# Altium schematic sheet Ring_wearable_ver3.4.SchDoc
size A2; SheetNumber: 1; SheetTotal: 2; SPICEModelCacheLMPAKEDT: <root> / <DocumentId>LMPAKEDT</DocumentId> / </root>
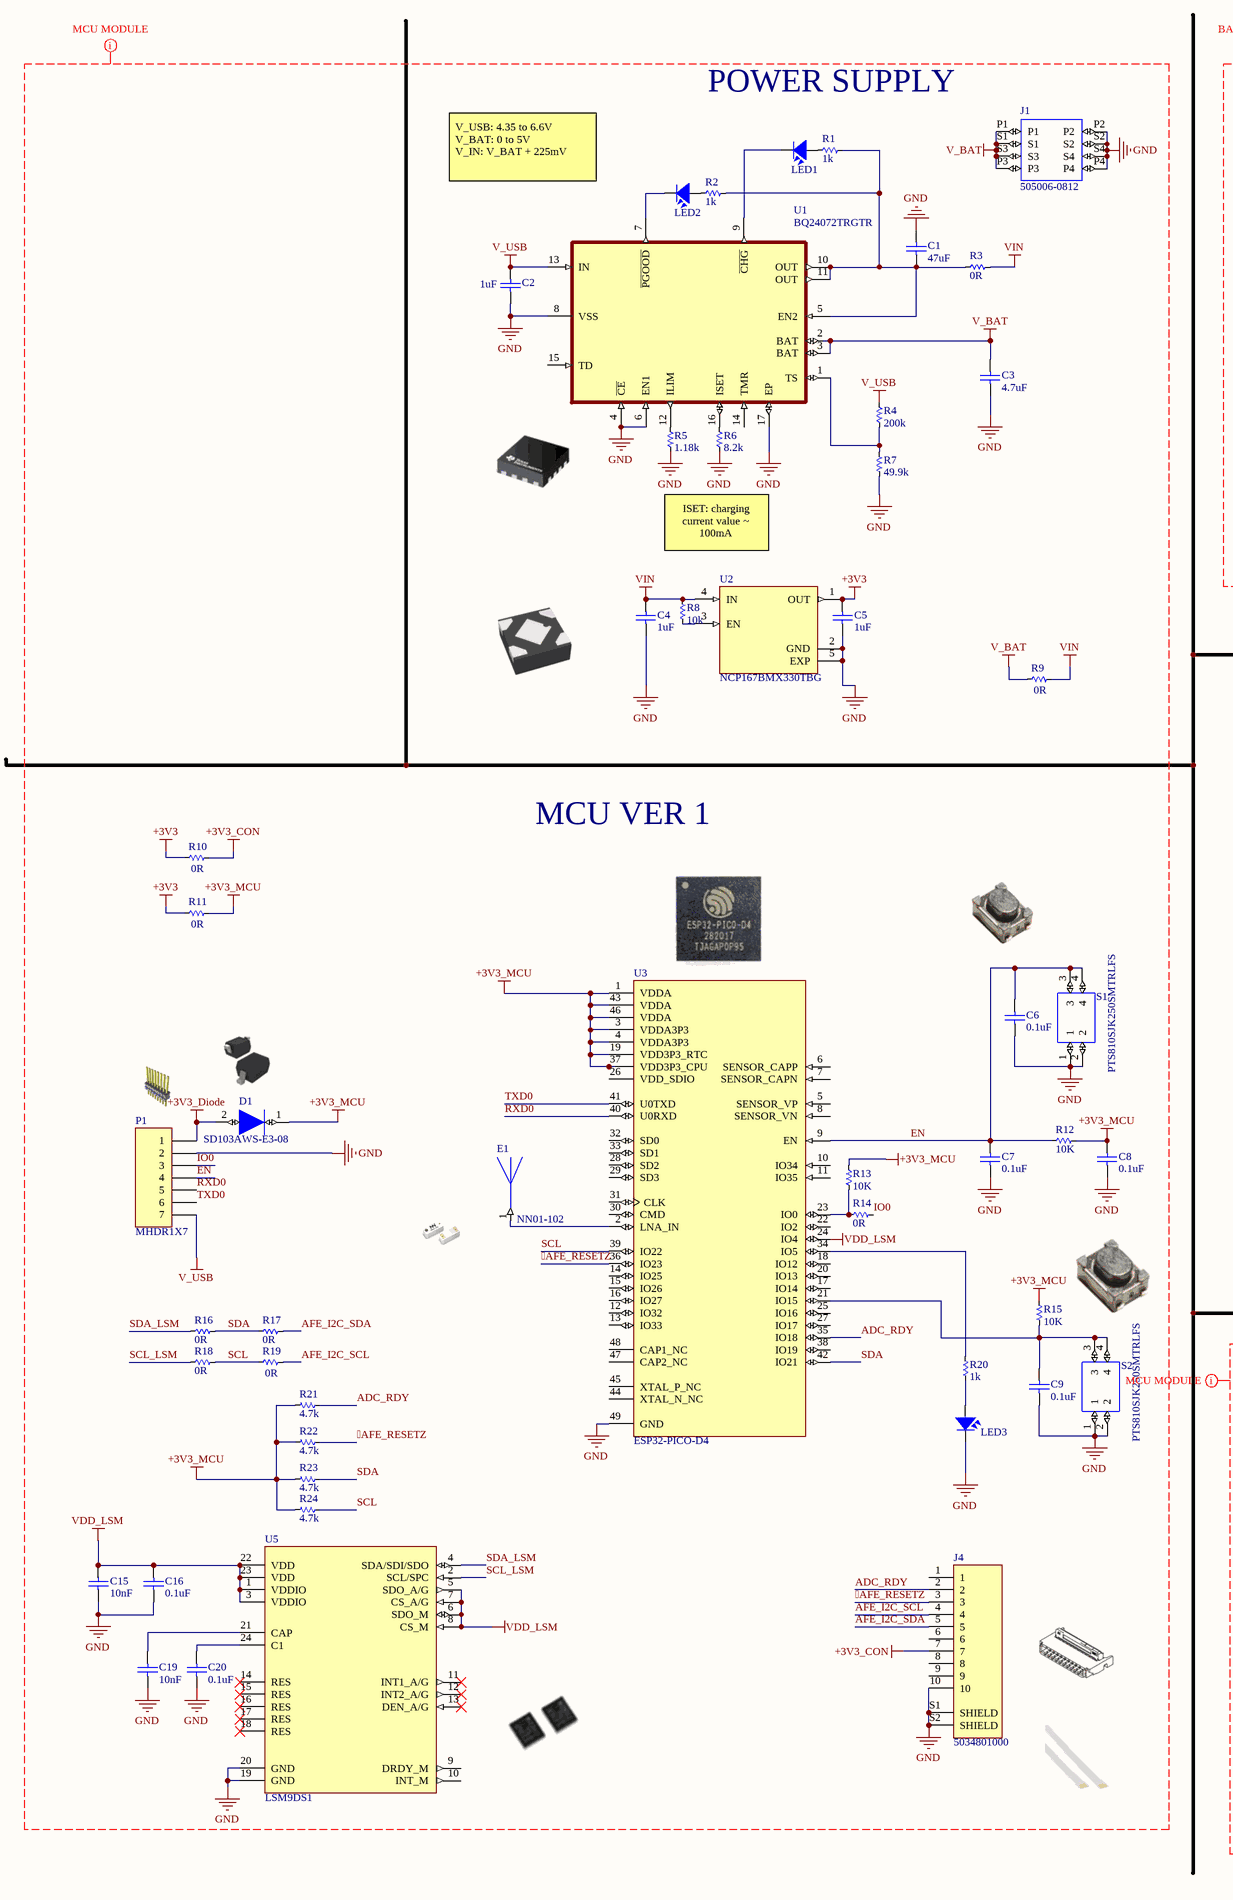
[diagram p0: Ring_wearable_ver3.4.SchDoc, left]
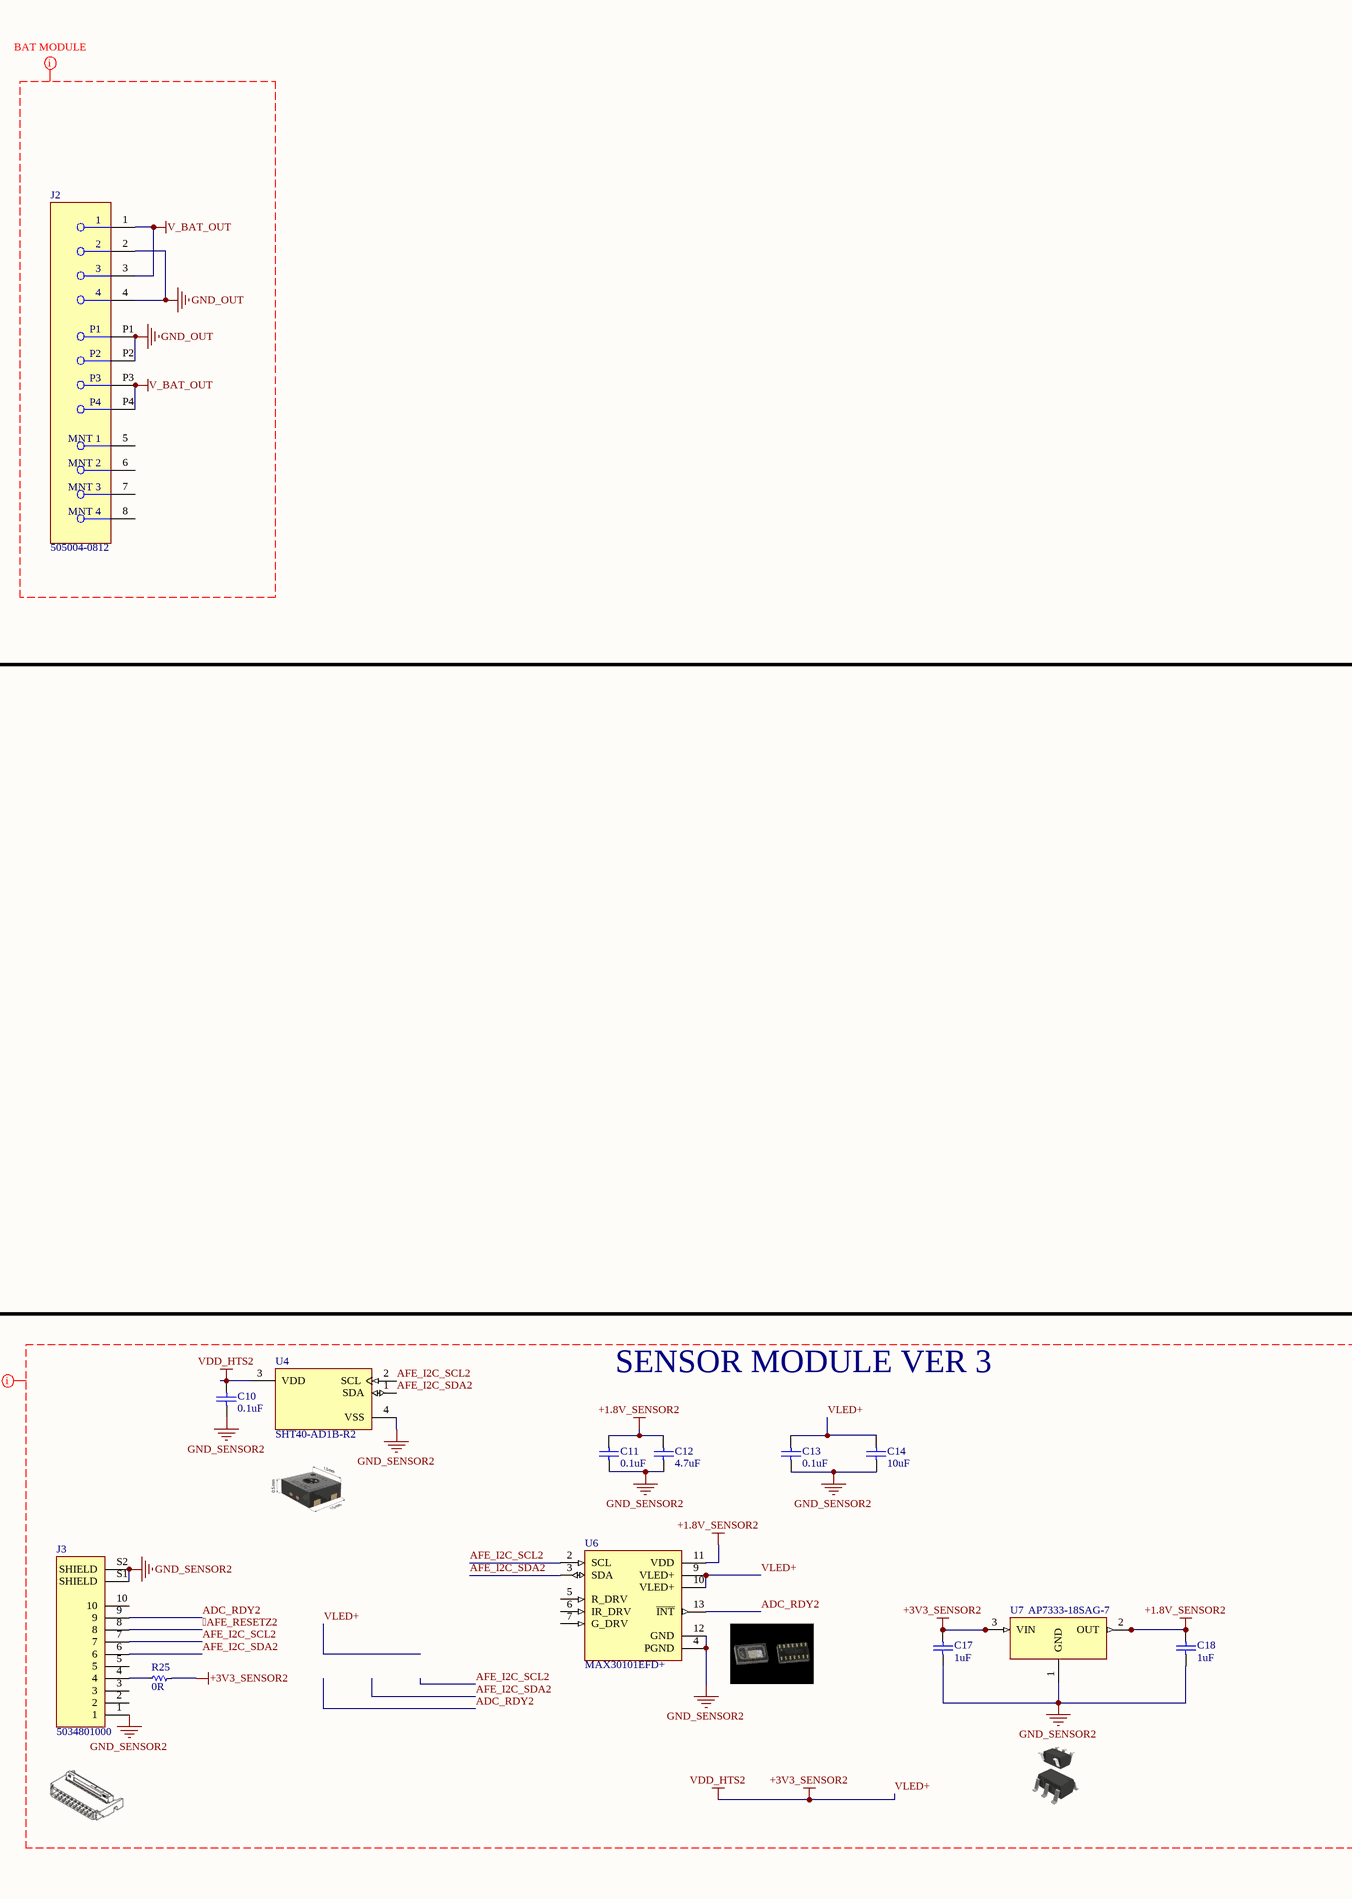
[diagram p1: Ring_wearable_ver3.4.SchDoc, right]

## Parts
C1  4.7uF  [RES-SMD-0402]  (value not drawn)
C2  1uF  [RES-SMD-0402]
C3  4.7uF  [RES-SMD-0402]
C4  1uF  [RES-SMD-0402]
C5  1uF  [RES-SMD-0402]
C6  0.1uF  [RES-SMD-0402]
C7  0.1uF  [RES-SMD-0603]
C8  0.1uF  [RES-SMD-0402]
C9  0.1uF  [RES-SMD-0402]
C10  0.1uF  [RES-SMD-0402]
C11  0.1uF  [RES-SMD-0402]
C12  4.7uF  [RES-SMD-0402]
C13  0.1uF  [RES-SMD-0402]
C14  10uF  [RES-SMD-0402]
C15  10nF  [RES-SMD-0402]
C16  0.1uF  [RES-SMD-0402]
C17  1uF  [RES-SMD-0402]
C18  1uF  [RES-SMD-0402]
C19  10nF  [RES-SMD-0402]
C20  0.1uF  [RES-SMD-0402]
D1  SD103AWS-E3-08  [SOD2713X115N]
E1  NN01-102  [XCVR_NN01-102]
J1  505006-0812  [5050060812]
J2  505004-0812  [FP-505004-0812-MFG]
J3  5034801000  [MOLEX_5034801000]
J4  5034801000  [MOLEX_5034801000]
LED1  LED_INDICATE1  [LED-0402]  (value not drawn)
LED2  LED_INDICATE2  [LED-0402]  (value not drawn)
LED3  LED_INDICATE3  [LED-0402]  (value not drawn)
P1  MHDR1X7  [MHDR1X7]
R1  1k  [RES-SMD-0402]
R2  1k  [RES-SMD-0402]
R3  0R  [RES-SMD-0402]
R4  200k  [RES-SMD-0402]
R5  1.18k  [RES-SMD-0402]
R6  8.2k  [RES-SMD-0402]
R7  49.9k  [RES-SMD-0402]
R8  10k  [RES-SMD-0402]
R9  0R  [RES-SMD-0402]
R10  0R  [RES-SMD-0402]
R11  0R  [RES-SMD-0402]
R12  10K  [RES-SMD-0402]
R13  10K  [RES-SMD-0603]
R14  0R  [RES-SMD-0603]
R15  10K  [RES-SMD-0402]
R16  0R  [RES-SMD-0402]
R17  0R  [RES-SMD-0402]
R18  0R  [RES-SMD-0402]
R19  0R  [RES-SMD-0402]
R20  1k  [RES-SMD-0402]
R21  4.7k  [RES-SMD-0402]
R22  4.7k  [RES-SMD-0402]
R23  4.7k  [RES-SMD-0402]
R24  4.7k  [RES-SMD-0402]
R25  0R  [RES-SMD-0402]
S1  PTS810SJK250SMTRLFS  [PTS810SJG250SMTRLFS]
S2  PTS810SJK250SMTRLFS  [PTS810SJG250SMTRLFS]
U1  BQ24072TRGTR  [QFN50P300X300X100-17N]
U2  NCP167BMX330TBG  [REG_NCP167BMX330TBG]
U3  ESP32-PICO-D4  [PQFN50P700X700X104-49N]
U4  SHT40-AD1B-R2  [FP-SHT40-AD1B-R2-MFG]
U5  LSM9DS1  [PQFN24P43_350X300X102L35X23N]
U6  MAX30101EFD+  [PSON80P330X560X165-14N]
U7  AP7333-18SAG-7  [SOT23-132]

## Nets
+1.8V_SENSOR2: C11.1 C12.1 C18.1 U6.11(VDD) U7.2(OUT)
+3V3: C5.1 R10.2 R11.2 U2.1(OUT)
+3V3_CON: J4.7 R10.1
+3V3_Diode: D1.2(A) P1.1
+3V3_MCU: C8.1 D1.1(K) R11.1 R12.1 R13.1 R15.1 R21.1 R22.1 R23.1 R24.1 U3.1(VDDA) U3.3(VDDA3P3) U3.4(VDDA3P3) U3.19(VDD3P3_RTC) U3.37(VDD3P3_CPU) U3.43(VDDA) U3.46(VDDA)
GND: C1.1 C2.1 C3.2 C4.2 C5.2 C6.2 C7.2 C8.2 C9.2 C15.2 C16.2 C19.2 C20.2 J1.P2 J1.P4 J1.S2 J1.S4 J4.10 J4.S1(SHIELD) J4.S2(SHIELD) LED3.2 P1.2 R5.1 R6.1 R7.1 S1.1 S1.2 S2.1 S2.2 U1.4(~{CE}) U1.6(EN1) U1.8(VSS) U1.17(EP) U2.2(GND) U2.5(EXP) U3.49(GND) U5.19(GND) U5.20(GND)
GND_OUT: J2.2 J2.4 J2.P1 J2.P2
GND_SENSOR2: C10.2 C11.2 C12.2 C13.2 C14.2 C17.2 C18.2 J3.1 J3.S1(SHIELD) J3.S2(SHIELD) U4.4(VSS) U6.4(PGND) U6.12(GND) U7.1(GND)
V_BAT: C3.1 J1.P1 J1.P3 J1.S1 J1.S3 R9.2 U1.2(BAT) U1.3(BAT)
V_BAT_OUT: J2.1 J2.3 J2.P3 J2.P4
V_USB: C2.2 P1.7 R4.2 U1.13(IN)
VDD_LSM: C15.1 C16.1 U3.24(IO4) U5.1(VDDIO) U5.3(VDDIO) U5.5(SDO_A/G) U5.6(SDO_M) U5.7(CS_A/G) U5.8(CS_M) U5.22(VDD) U5.23(VDD)
VIN: C4.1 R3.1 R8.2 R9.1 U2.4(IN)
VLED+: C10.1 C13.1 C14.1 C17.1 R25.1 U4.3(VDD) U6.9(VLED+) U6.10(VLED+) U7.3(VIN)  [also labelled +3V3_SENSOR2, VDD_HTS2]
AFE_RESETZ: J4.3 R22.2 U3.36(IO23)
AFE_RESETZ2: J3.8
ADC_RDY: J4.2 R21.2 U3.35(IO18)
ADC_RDY2: J3.9 U6.13(~{INT})
AFE_I2C_SCL: J4.4 R19.1
AFE_I2C_SCL2: J3.7 U4.2(SCL) U6.2(SCL)
AFE_I2C_SDA: J4.5 R17.1
AFE_I2C_SDA2: J3.6 U4.1(SDA) U6.3(SDA)
EN: C6.1 C7.1 P1.4 R12.2 S1.3 S1.4 U3.9(EN)
IO0: P1.3 R14.1
RXD0: P1.5 U3.40(U0RXD)
SCL: R18.1 R19.2 R24.2 U3.39(IO22)
SCL_LSM: R18.2 U5.2(SCL/SPC)
SDA: R16.1 R17.2 R23.2 U3.42(IO21)
SDA_LSM: R16.2 U5.4(SDA/SDI/SDO)
TXD0: P1.6 U3.41(U0TXD)
NetC1_2: C1.2 R1.1 R2.1 R3.2 U1.5(EN2) U1.10(OUT) U1.11(OUT)
NetC9_1: C9.1 R15.2 S2.3 S2.4 U3.21(IO15)
NetC19_1: C19.1 U5.21(CAP)
NetC20_1: C20.1 U5.24(C1)
NetE1_1: E1.1 U3.2(LNA_IN)
NetJ3_4: J3.4 R25.2
NetLED1_1: LED1.1 R1.2
NetLED1_2: LED1.2 U1.9(~{CHG})
NetLED2_1: LED2.1 R2.2
NetLED2_2: LED2.2 U1.7(~{PGOOD})
NetLED3_1: LED3.1 R20.2
NetR4_1: R4.1 R7.2 U1.1(TS)
NetR5_2: R5.2 U1.12(ILIM)
NetR6_2: R6.2 U1.16(ISET)
NetR8_1: R8.1 U2.3(EN)
NetR13_2: R13.2 R14.2 U3.23(IO0)
NetR20_1: R20.1 U3.34(IO5)

Not connected (* = marked no-connect by the designer): J2 5(MNT_1) 6(MNT_2) 7(MNT_3) 8(MNT_4); J3 2 3 5 10; J4 1 6 8 9; U1 14(TMR) 15(TD); U3 5(SENSOR_VP) 6(SENSOR_CAPP) 7(SENSOR_CAPN) 8(SENSOR_VN) 10(IO34) 11(IO35) 12(IO32) 13(IO33) 14(IO25) 15(IO26) 16(IO27) 17(IO14) 18(IO12) 20(IO13) 22(IO2) 25(IO16) 26(VDD_SDIO) 27(IO17) 28(SD2) 29(SD3) 30(CMD) 31(CLK) 32(SD0) 33(SD1) 38(IO19) 44(XTAL_N_NC) 45(XTAL_P_NC) 47(CAP2_NC) 48(CAP1_NC); U5 9(DRDY_M) 10(INT_M) 11(INT1_A/G)* 12(INT2_A/G)* 13(DEN_A/G)* 14(RES)* 15(RES)* 16(RES)* 17(RES)* 18(RES)*; U6 5(R_DRV) 6(IR_DRV) 7(G_DRV)

## Layout directives
net class MCU: AFE_RESETZ, AFE_RESETZ2, +1.8V_SENSOR2, +3V3, +3V3_CON, +3V3_Diode, +3V3_MCU, +3V3_SENSOR2, ADC_RDY, ADC_RDY2, AFE_I2C_SCL, AFE_I2C_SCL2, AFE_I2C_SDA, AFE_I2C_SDA2, EN, GND, GND_SENSOR2, IO0, RXD0, SCL, SCL_LSM, SDA, SDA_LSM, TXD0, V_BAT, V_USB, VDD_HTS2, VDD_LSM, VIN, VLED+
net class BAT MODULE: GND_OUT, V_BAT_OUT

## Notes on the sheet
- POWER SUPPLY
- V_USB: 4.35 to 6.6V
  V_BAT: 0 to 5V
  V_IN: V_BAT + 225mV
- ISET: charging current value ~ 100mA
- MCU VER 1
- SENSOR MODULE VER 3
- (in symbol Cap) 47uF

## Library data of the parts
C1-C20 = Cap: Capacitor; Published: 8-Jun-2000; LatestRevisionDate: 17-Jul-2002; LatestRevisionNote: Re-released for DXP Platform.; PackageReference: RAD-0.3; Publisher: Altium Limited; PackageDescription: Radial Cap, Thru-Hole; 2 Leads; 0.3 in Pin Spacing
D1 = SD103AWS-E3-08: Ð”Ð¸Ð¾Ð´ Ð¨Ð¾Ñ‚Ñ‚ÐºÐ¸ 40 Ð’ 350 Ð¼Ð (DC) Ð´Ð»Ñ Ð¿Ð¾Ð²ÐµÑ€Ñ…Ð½Ð¾ÑÑ‚Ð½Ð¾Ð³Ð¾ Ð¼Ð¾Ð½Ñ‚Ð°Ð¶Ð° SOD-323; MF: Vishay; SnapEDA_Link: https://www.snapeda.com/parts/SD103AWS-E3-08/Vishay+Semiconductor+Diodes+Division/view-part/?ref=snap; Value: *; Purchase-URL: https://pricing.snapeda.com/search/part/SD103AWS-E3-08/?ref=eda; Digi-Key_Part_Number: SD103AWS-E3-08GITR-ND; Check_prices: https://www.snapeda.com/parts/SD103AWS-E3-08/Vishay+Semiconductor+Diodes+Division/view-part/?ref=eda; MP: SD103AWS-E3-08; Package: SOD-323 Vishay Semiconductor Diodes Division
E1 = NN01-102: 2.45GHz Bluetooth, WLAN, Zigbeeâ„¢ Chip RF Antenna 2.4GHz ~ 2.5GHz 1.7dBi Solder Surface Mount; MF: Ignion; Price: None; Availability: In Stock; Check_prices: https://www.snapeda.com/parts/NN01-102/Ignion/view-part/5139104/?ref=eda; Value: *; MP: NN01-102; Package: None; SnapEDA_Link: https://www.snapeda.com/parts/NN01-102/Ignion/view-part/5139104/?ref=snap
J1 = 505006-0812: 8 (4 + 4 Power) Position Connector Plug, Outer Shroud Contacts Surface Mount Gold; MF: Molex; Value: *; SnapEDA_Link: https://www.snapeda.com/parts/505006-0812/Molex/view-part/3230025/?ref=snap; Package: None; Check_prices: https://www.snapeda.com/parts/505006-0812/Molex/view-part/3230025/?ref=eda; MP: 505006-0812; Availability: Unavailable; Price: None
J2 = CMP-04776-000740-1: CONN RCPT 4POS SMD GOLD
J3 J4 = 5034801000: 10 Position FFC, FPC Connector Contacts, Top and Bottom 0.020 _0.50mm_ Surface Mount, Right Angle; MF: Molex; Digi-Key_Part_Number: WM1389CT-ND; Package: None; MP: 5034801000; Digi-Key_Purchase_URL: https://www.digikey.com/product-detail/en/molex/5034801000/WM1389CT-ND/2356643?utm_source=snapeda&utm_medium=aggregator&utm_campaign=symbol; SnapEDA_Link: https://www.snapeda.com/parts/5034801000/Molex/view-part/2746786/?ref=snap; Value: *
LED1-LED3 = LED: LED Single colour Green and Red; Value: LED 3 ly Single Colour
P1 = MHDR1X7: Header, 7-Pin; LatestRevisionDate: 17-Jul-2002; LatestRevisionNote: Re-released for DXP Platform.; Publisher: Altium Limited
R1-R25 = Res-SMD: Resistor; Manufacturer: Generic Components; Class: Passive; Published: 08/06/2000; Publisher: Altium Hobart Technology Centre
S1 S2 = PTS810SJK250SMTRLFS: Tactile Switch SPST-NO Top Actuated Surface Mount; MF: C&K; SnapEDA_Link: https://www.snapeda.com/parts/PTS810SJK250SMTRLFS/C%26K/view-part/274682/?ref=snap; Package: None; Price: None; MP: PTS810SJK250SMTRLFS; Availability: Unavailable; Value: *
U1 = BQ24072TRGTR: Standalone 1-cell 1.5-A linear charger, Power Path, 4.2-V VBAT, Voltage-based TS w/ TD 16-VQFN -40 to 85; MF: Texas Instruments; Texas_Instruments-Purchase-URL: https://snapeda.com/shop?store=Texas+Instruments&id=42614; Mouser-Purchase-URL: https://snapeda.com/shop?store=Mouser&id=42614; SnapEDA_Link: https://www.snapeda.com/parts/BQ24072TRGTR/Texas%20Instruments/view-part/42614/?ref=snap; Availability: Good; MP: BQ24072TRGTR; DigiKey-Purchase-URL: https://snapeda.com/shop?store=DigiKey&id=42614; Package: VQFN-16 Texas Instruments; Value: *; Price: None; Arrow_Electronics-Purchase-URL: https://snapeda.com/shop?store=Arrow+Electronics&id=42614
U2 = NCP167BMX330TBG: Linear Voltage Regulator IC 1 Output 700mA 4-XDFN _1x1_; MF: ON Semiconductor; Digi-Key_Part_Number: NCP167BMX330TBGOSCT-ND; Package: XDFN-4 ON Semiconductor; MP: NCP167BMX330TBG; SnapEDA_Link: https://www.snapeda.com/parts/NCP167BMX330TBG/ON%20Semiconductor/view-part/3624496/?ref=snap; Digi-Key_Purchase_URL: https://www.digikey.de/product-detail/en/on-semiconductor/NCP167BMX330TBG/NCP167BMX330TBGOSCT-ND/9749419?utm_source=snapeda&utm_medium=aggregator&utm_campaign=symbol; Value: *
U3 = ESP32-PICO-D4: Bluetooth, WiFi 802.11b/g/n, Bluetooth v4.2 +EDR, Class 1, 2 and 3 Transceiver Module 2.4GHz ~ 2.5GHz Surface Mount; Price: None; Package: None; Availability: Unavailable; MP: ESP32-PICO-D4; Value: *
U4 = CMP-144040-000008-1: SENSOR HUMIDITY 100 RH SMD
U5 = LSM9DS1: Accelerometer, Gyroscope, Magnetometer, Temperature, 9 Axis Sensor IÂ²C, SPI Output; MF: STMicroelectronics; SnapEDA_Link: https://www.snapeda.com/parts/LSM9DS1/STMicroelectronics/view-part/230981/?ref=snap; Availability: Unavailable; Price: None; Package: TFLGA-24 STMicroelectronics; MP: LSM9DS1; Value: *
U6 = MAX30101EFD+: Oximeter/Heart Rate Sensor IÂ²C Output; MF: Maxim Integrated; MP: MAX30101EFD+; SnapEDA_Link: https://www.snapeda.com/parts/MAX30101EFD+/Maxim%20Integrated/view-part/554104/?ref=snap; Value: *; DigiKey-Purchase-URL: https://snapeda.com/shop?store=DigiKey&id=554104; Package: OLGA-14 Maxim; Price: None; Availability: Unavailable
U7 = AP7370-18SA-7